# EasyEDA schematic ProjectSIT210.json
TITLE: Sheet_1; REV: 1.0; Date: 2021-05-25; Sheet: 1/1; Company: Your Company
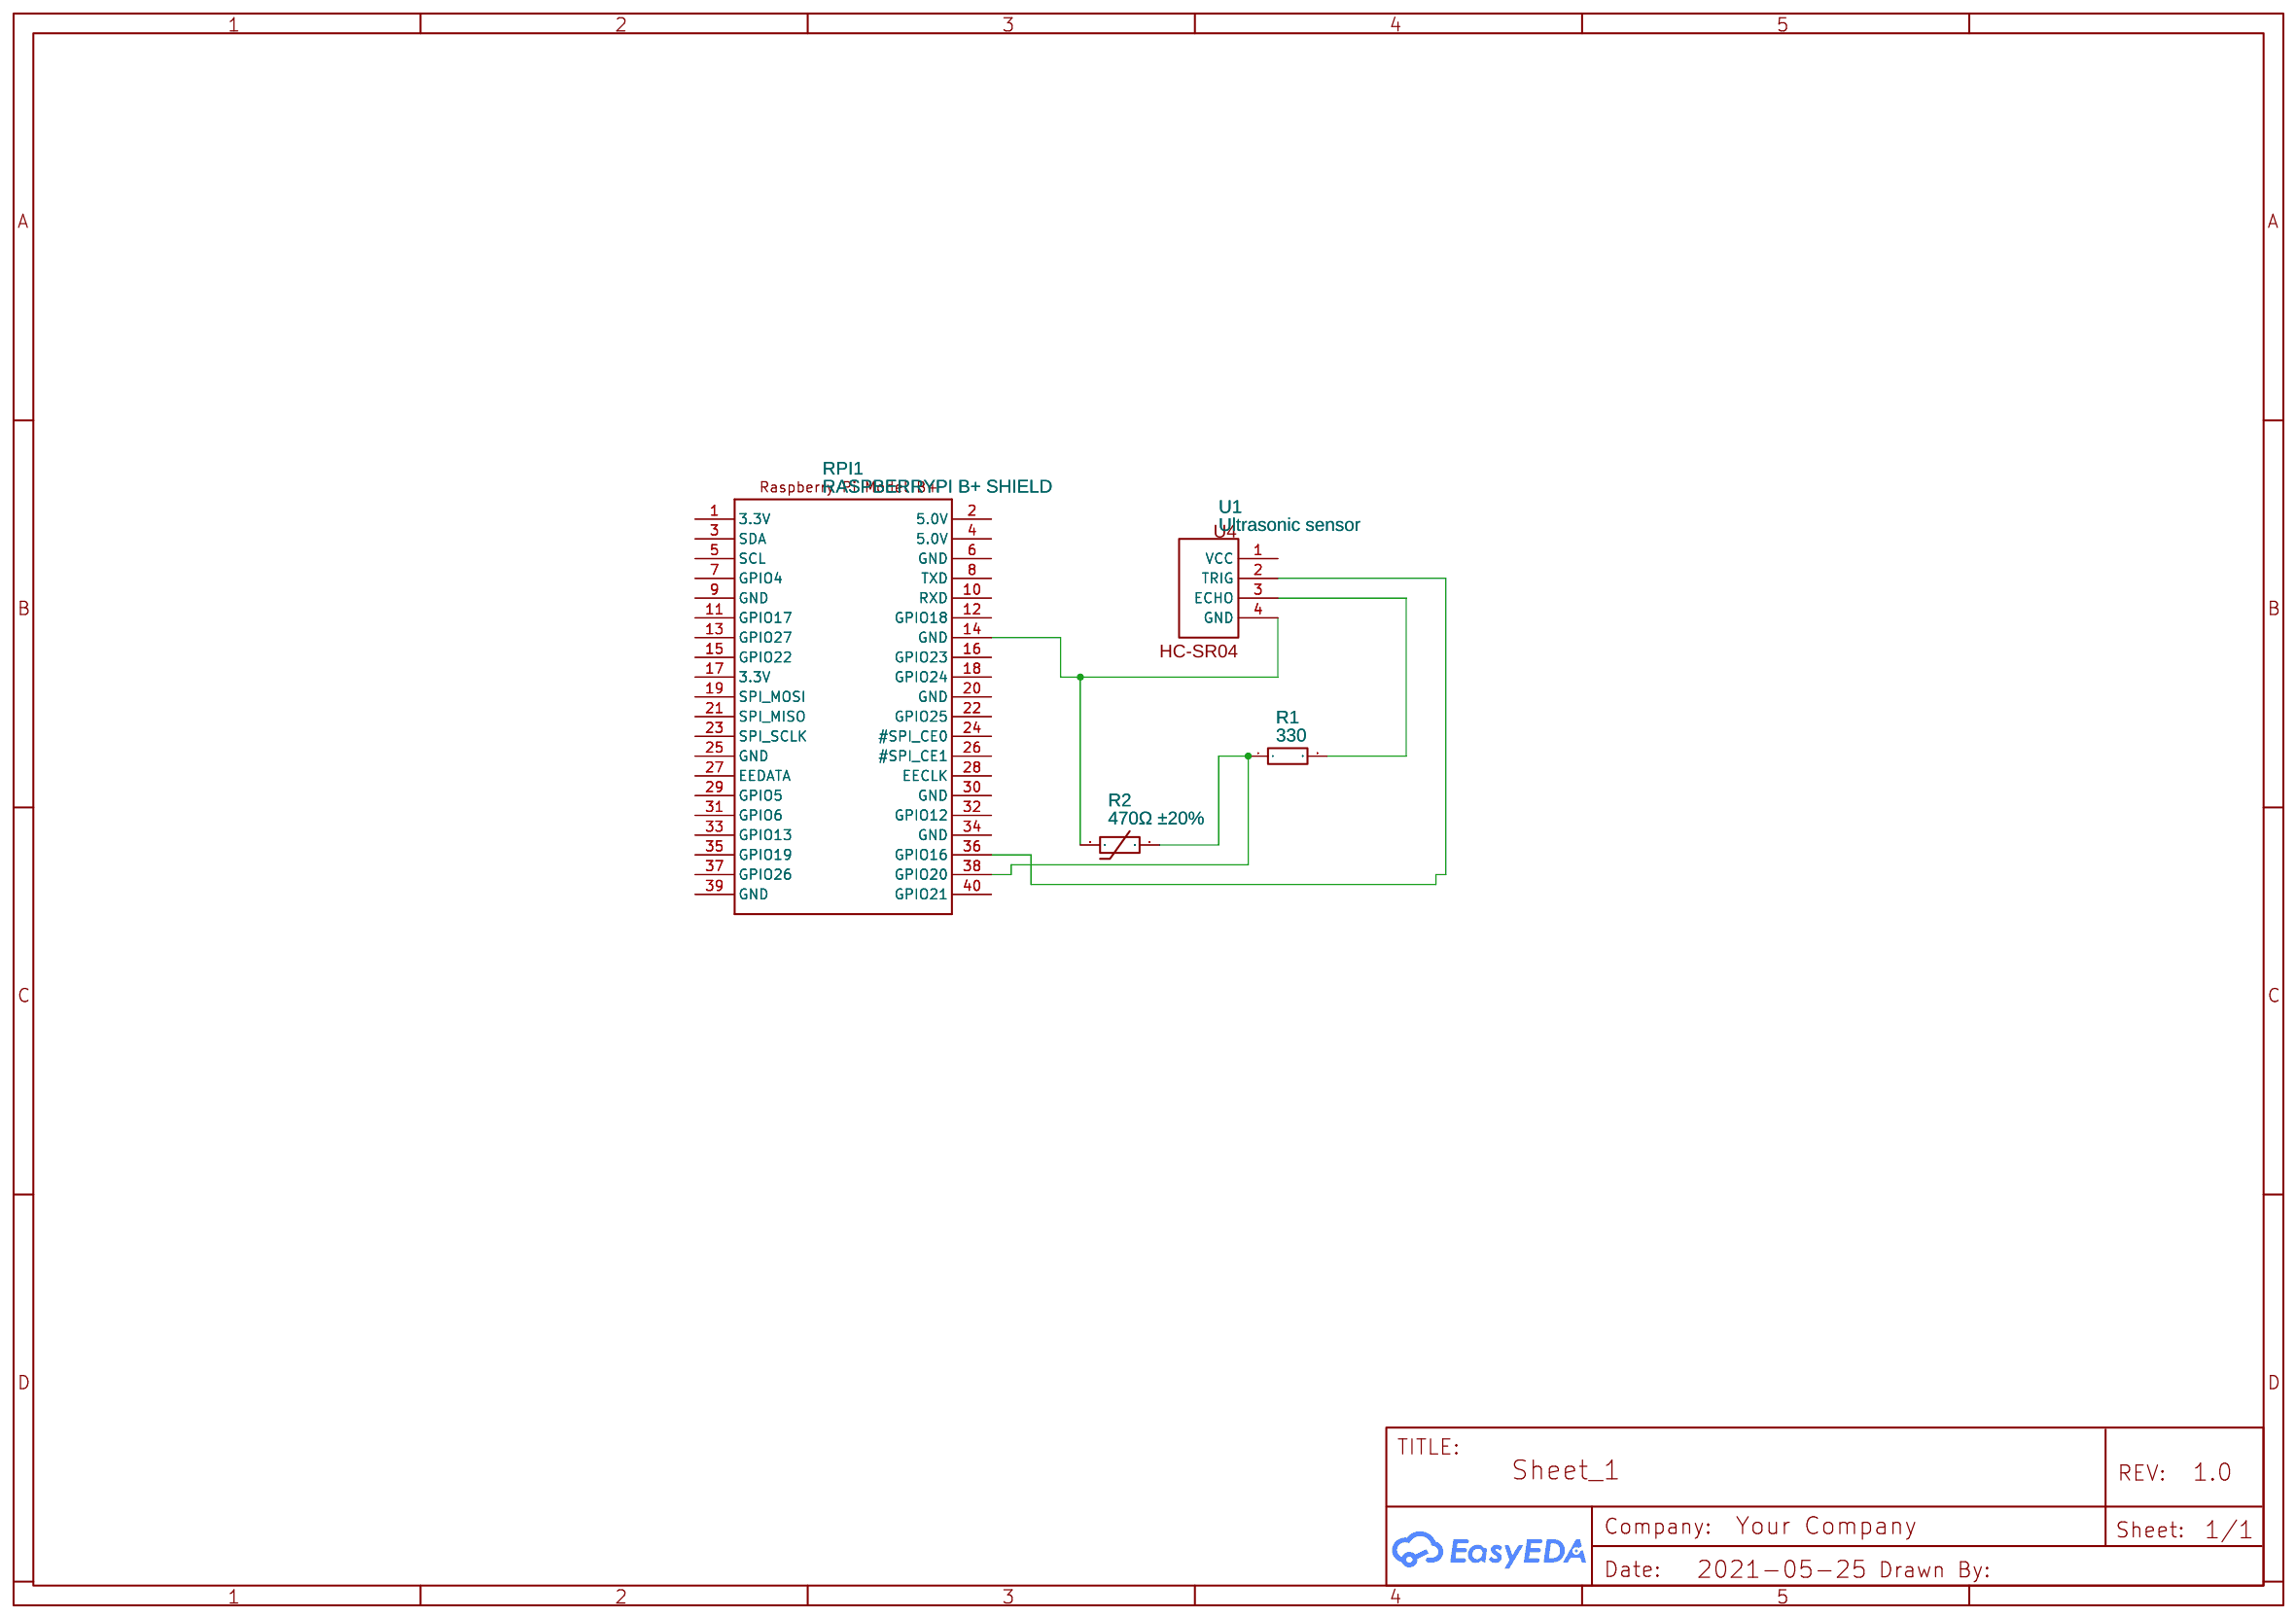
[diagram p0: schematic sheet]

## Parts
R1  330  [RES-TH_BD2.3-L6.5-P6.9-D0.5]
R2  470Ω ±20%  [RES-TH_L7.0-W4.0-P2.50-D1.0-S2.00]
RPI1  RASPBERRYPI B+ SHIELD  [RASPBERRYPI B+ SHIELD]
U1  Ultrasonic sensor  [ULTRASONIC SENSOR]

## Library data of the parts
R1 = 330Ω (331) ±5%: Supplier: LCSC; Supplier Part: C10322; Manufacturer: Made in China; Contributor: LCSC
R2 = 470Ω ±20%: Supplier: LCSC; Supplier Part: C123348; Manufacturer: Nanjing Shiheng Elec; Manufacturer Part: MF11 471M; Contributor: LCSC; JLCPCB Part Class: Extended Part
RPI1 = RASPBERRYPI B+ SHIELD: Contributor: cyberterminal
U1 = Ultrasonic sensor: Manufacturer Part: ULTRASONIC-HC-SR04; Contributor: Liya1999

## Nets
Net-(R1-1): R1.1 R2.2 RPI1.38(GPIO20)
Net-(R1-2): R1.2 U1.3(ECHO)
Net-(R2-1): R2.1 RPI1.14(GND) U1.4(GND)
Net-(RPI1-36): RPI1.36(GPIO16) U1.2(TRIG)

Not connected (* = marked no-connect by the designer): RPI1 1(3.3V) 2(5.0V) 3(SDA) 4(5.0V) 5(SCL) 6(GND) 7(GPIO4) 8(TXD) 9(GND) 10(RXD) 11(GPIO17) 12(GPIO18) 13(GPIO27) 15(GPIO22) 16(GPIO23) 17(3.3V) 18(GPIO24) 19(SPI_MOSI) 20(GND) 21(SPI_MISO) 22(GPIO25) 23(SPI_SCLK) 24(#SPI_CE0) 25(GND) 26(#SPI_CE1) 27(EEDATA) 28(EECLK) 29(GPIO5) 30(GND) 31(GPIO6) 32(GPIO12) 33(GPIO13) 34(GND) 35(GPIO19) 37(GPIO26) 39(GND) 40(GPIO21); U1 1(VCC)
